# Altium schematic sheet SCH_POTENCIA.SchDoc: TP Final - Reloj - Potencia
size A4; Author: Luciano Lopez; CompanyName: UTN - FRBA; Revision: 1; SheetNumber: 4; SheetTotal: 10
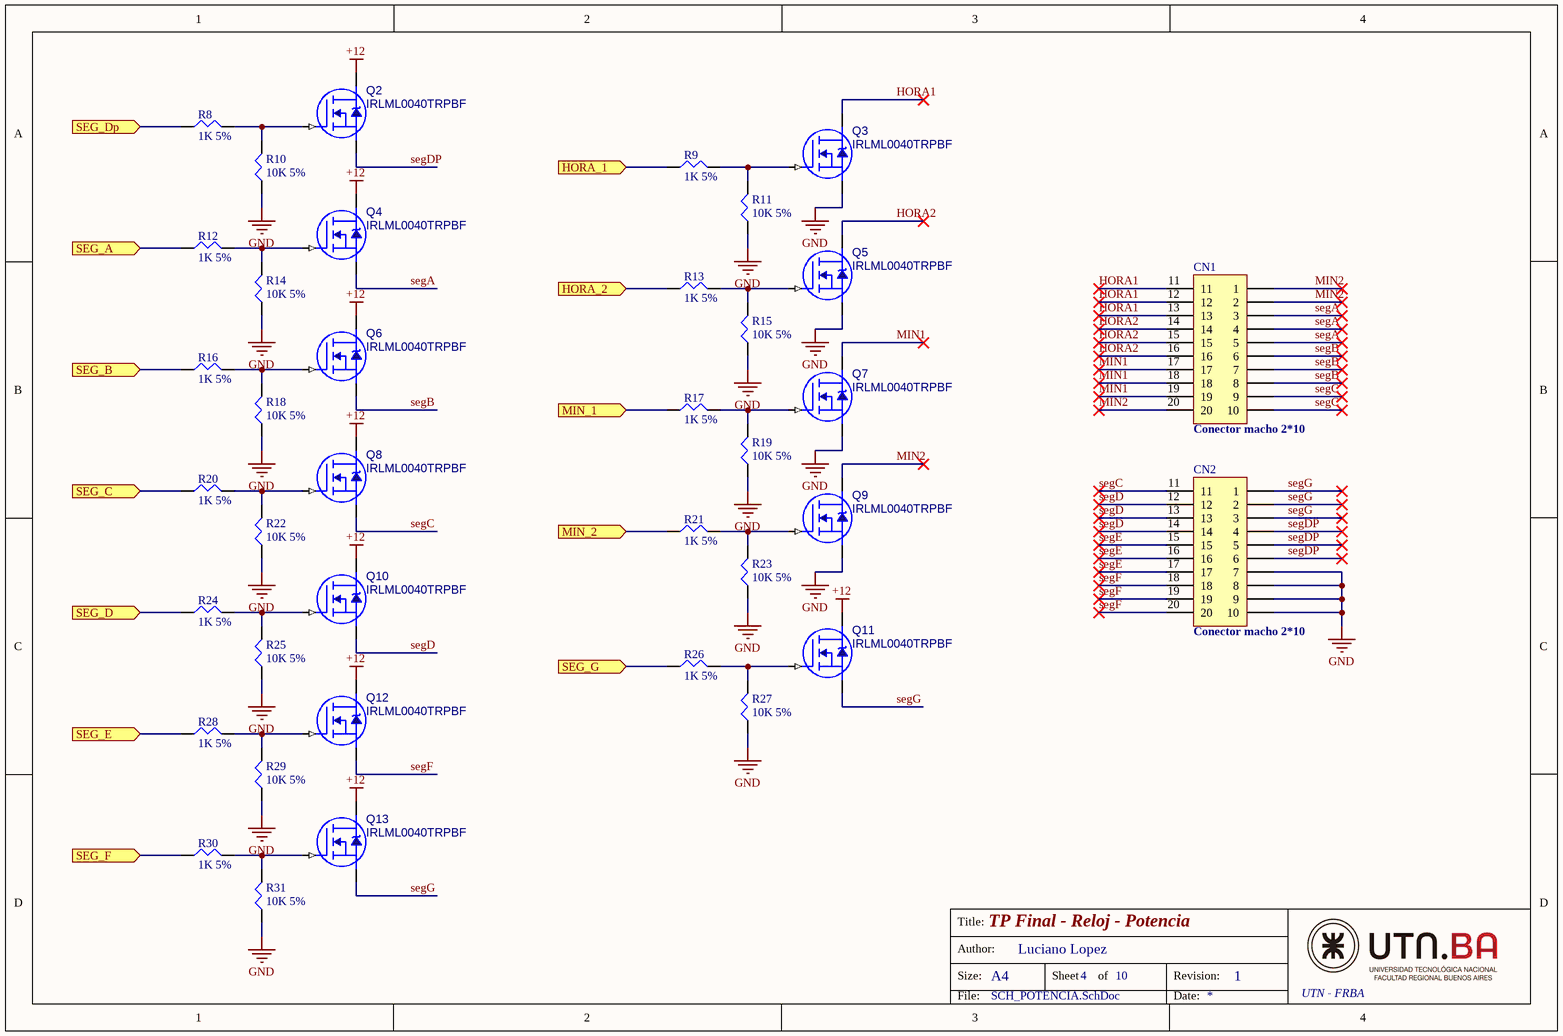
[diagram p0: SCH_POTENCIA.SchDoc]

## Parts
CN1  Conector macho 2*10
CN2  Conector macho 2*10
Q2  IRLML0040TRPBF  [IC_SOT-23]
Q3  IRLML0040TRPBF  [IC_SOT-23]
Q4  IRLML0040TRPBF  [IC_SOT-23]
Q5  IRLML0040TRPBF  [IC_SOT-23]
Q6  IRLML0040TRPBF  [IC_SOT-23]
Q7  IRLML0040TRPBF  [IC_SOT-23]
Q8  IRLML0040TRPBF  [IC_SOT-23]
Q9  IRLML0040TRPBF  [IC_SOT-23]
Q10  IRLML0040TRPBF  [IC_SOT-23]
Q11  IRLML0040TRPBF  [IC_SOT-23]
Q12  IRLML0040TRPBF  [IC_SOT-23]
Q13  IRLML0040TRPBF  [IC_SOT-23]
R8  1K 5%  [R_0805]
R9  1K 5%  [R_0805]
R10  10K 5%  [R_0805]
R11  10K 5%  [R_0805]
R12  1K 5%  [R_0805]
R13  1K 5%  [R_0805]
R14  10K 5%  [R_0805]
R15  10K 5%  [R_0805]
R16  1K 5%  [R_0805]
R17  1K 5%  [R_0805]
R18  10K 5%  [R_0805]
R19  10K 5%  [R_0805]
R20  1K 5%  [R_0805]
R21  1K 5%  [R_0805]
R22  10K 5%  [R_0805]
R23  10K 5%  [R_0805]
R24  1K 5%  [R_0805]
R25  10K 5%  [R_0805]
R26  1K 5%  [R_0805]
R27  10K 5%  [R_0805]
R28  1K 5%  [R_0805]
R29  10K 5%  [R_0805]
R30  1K 5%  [R_0805]
R31  10K 5%  [R_0805]

## Ports
HORA_1 (in), HORA_2 (in), MIN_1 (in), MIN_2 (in), SEG_A (in), SEG_B (in), SEG_C (in), SEG_D (in), SEG_Dp (in), SEG_E (in), SEG_F (in), SEG_G (in)

## Nets
+12: Q2.3(DRAIN) Q4.3(DRAIN) Q6.3(DRAIN) Q8.3(DRAIN) Q10.3(DRAIN) Q11.3(DRAIN) Q12.3(DRAIN) Q13.3(DRAIN)
GND: CN2.7 CN2.8 CN2.9 CN2.10 Q3.2(SOURCE) Q5.2(SOURCE) Q7.2(SOURCE) Q9.2(SOURCE) R10.1 R11.1 R14.1 R15.1 R18.1 R19.1 R22.1 R23.1 R25.1 R27.1 R29.1 R31.1
HORA1: CN1.11 CN1.12 CN1.13 Q3.3(DRAIN)
HORA2: CN1.14 CN1.15 CN1.16 Q5.3(DRAIN)
HORA_1: R9.1 ; port HORA_1
HORA_2: R13.1 ; port HORA_2
MIN1: CN1.17 CN1.18 CN1.19 Q7.3(DRAIN)
MIN2: CN1.1 CN1.2 CN1.20 Q9.3(DRAIN)
MIN_1: R17.1 ; port MIN_1
MIN_2: R21.1 ; port MIN_2
SEG_A: R12.1 ; port SEG_A
SEG_B: R16.1 ; port SEG_B
SEG_C: R20.1 ; port SEG_C
SEG_D: R24.1 ; port SEG_D
SEG_Dp: R8.1 ; port SEG_Dp
SEG_E: R28.1 ; port SEG_E
SEG_F: R30.1 ; port SEG_F
SEG_G: R26.1 ; port SEG_G
segA: CN1.3 CN1.4 CN1.5 Q4.2(SOURCE)
segB: CN1.6 CN1.7 CN1.8 Q6.2(SOURCE)
segC: CN1.9 CN1.10 CN2.11 Q8.2(SOURCE)
segD: CN2.12 CN2.13 CN2.14 Q10.2(SOURCE)
segDP: CN2.4 CN2.5 CN2.6 Q2.2(SOURCE)
segE: CN2.15 CN2.16 CN2.17
segF: CN2.18 CN2.19 CN2.20 Q12.2(SOURCE)
segG: CN2.1 CN2.2 CN2.3 Q11.2(SOURCE) Q13.2(SOURCE)
NetQ2_1: Q2.1(GATE) R8.2 R10.2
NetQ3_1: Q3.1(GATE) R9.2 R11.2
NetQ4_1: Q4.1(GATE) R12.2 R14.2
NetQ5_1: Q5.1(GATE) R13.2 R15.2
NetQ6_1: Q6.1(GATE) R16.2 R18.2
NetQ7_1: Q7.1(GATE) R17.2 R19.2
NetQ8_1: Q8.1(GATE) R20.2 R22.2
NetQ9_1: Q9.1(GATE) R21.2 R23.2
NetQ10_1: Q10.1(GATE) R24.2 R25.2
NetQ11_1: Q11.1(GATE) R26.2 R27.2
NetQ12_1: Q12.1(GATE) R28.2 R29.2
NetQ13_1: Q13.1(GATE) R30.2 R31.2

## Notes on the sheet
- Title:
- Size:
- Author:
- A4
- Sheet
- of
- Revision:
- File:
- Date:

## Library data of the parts
CN1 CN2 = CONN_2x10P: Connector Generic 10 Vias
Q2-Q13 = N_MOSFET_SOT23: Mosfet N-Ch
R8-R31 = Resistor